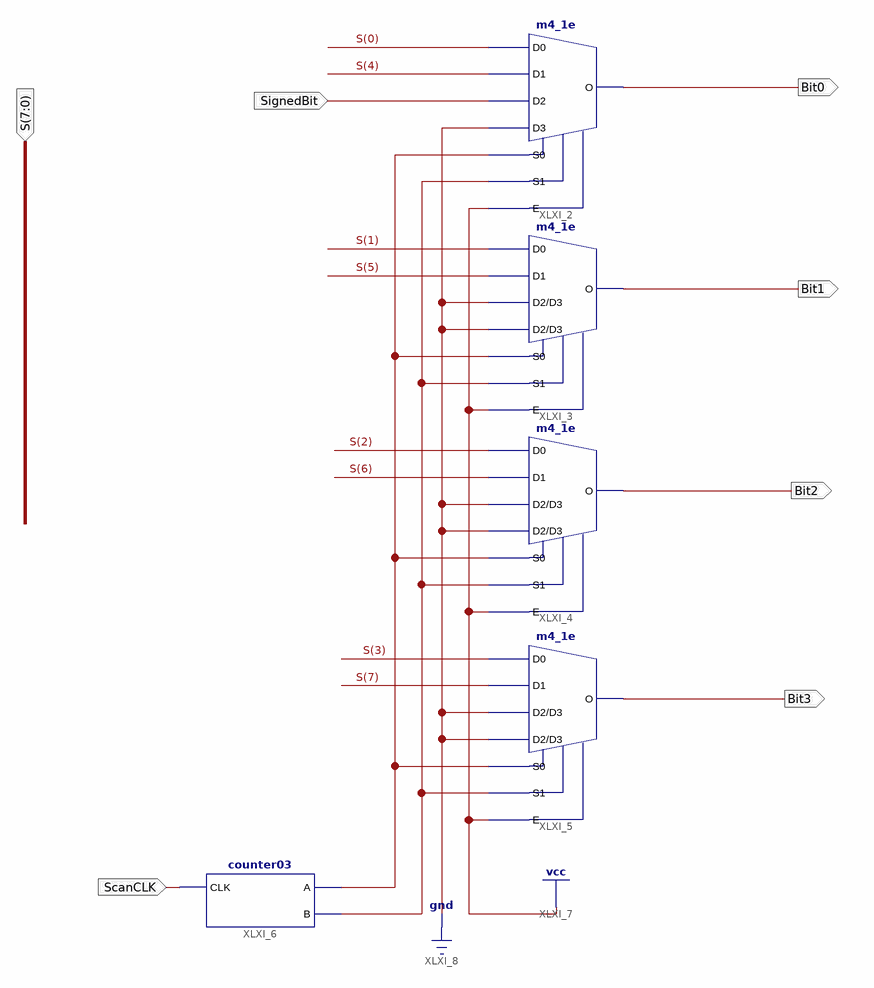
[diagram p0: schematic sheet 1]
// Xilinx ISE schematic Mux8to1_4.sch (spartan6) as structural Verilog: 5 symbols, 7 ports
module Mux8to1_4 (
  input  ScanCLK,
  input  SignedBit,
  input  [7:0] S,
  output Bit0,
  output Bit1,
  output Bit2,
  output Bit3
);

  wire XLXN_2, XLXN_3;

  m4_1e XLXI_2 (.D0(S[0]), .D1(S[4]), .D2(SignedBit), .D3(1'b0), .E(1'b1), .S0(XLXN_2), .S1(XLXN_3), .O(Bit0));
  m4_1e XLXI_3 (.D0(S[1]), .D1(S[5]), .D2(1'b0), .D3(1'b0), .E(1'b1), .S0(XLXN_2), .S1(XLXN_3), .O(Bit1));
  m4_1e XLXI_4 (.D0(S[2]), .D1(S[6]), .D2(1'b0), .D3(1'b0), .E(1'b1), .S0(XLXN_2), .S1(XLXN_3), .O(Bit2));
  m4_1e XLXI_5 (.D0(S[3]), .D1(S[7]), .D2(1'b0), .D3(1'b0), .E(1'b1), .S0(XLXN_2), .S1(XLXN_3), .O(Bit3));
  counter03 XLXI_6 (.CLK(ScanCLK), .A(XLXN_2), .B(XLXN_3));
endmodule
